# EAGLE design hapcan-dali (EAGLE 7.5.0)
PRODUCT_COMPANY: skagmo.com, 2015; PRODUCT_TITLE: HAPCAN compatible DALI gateway, rev. A
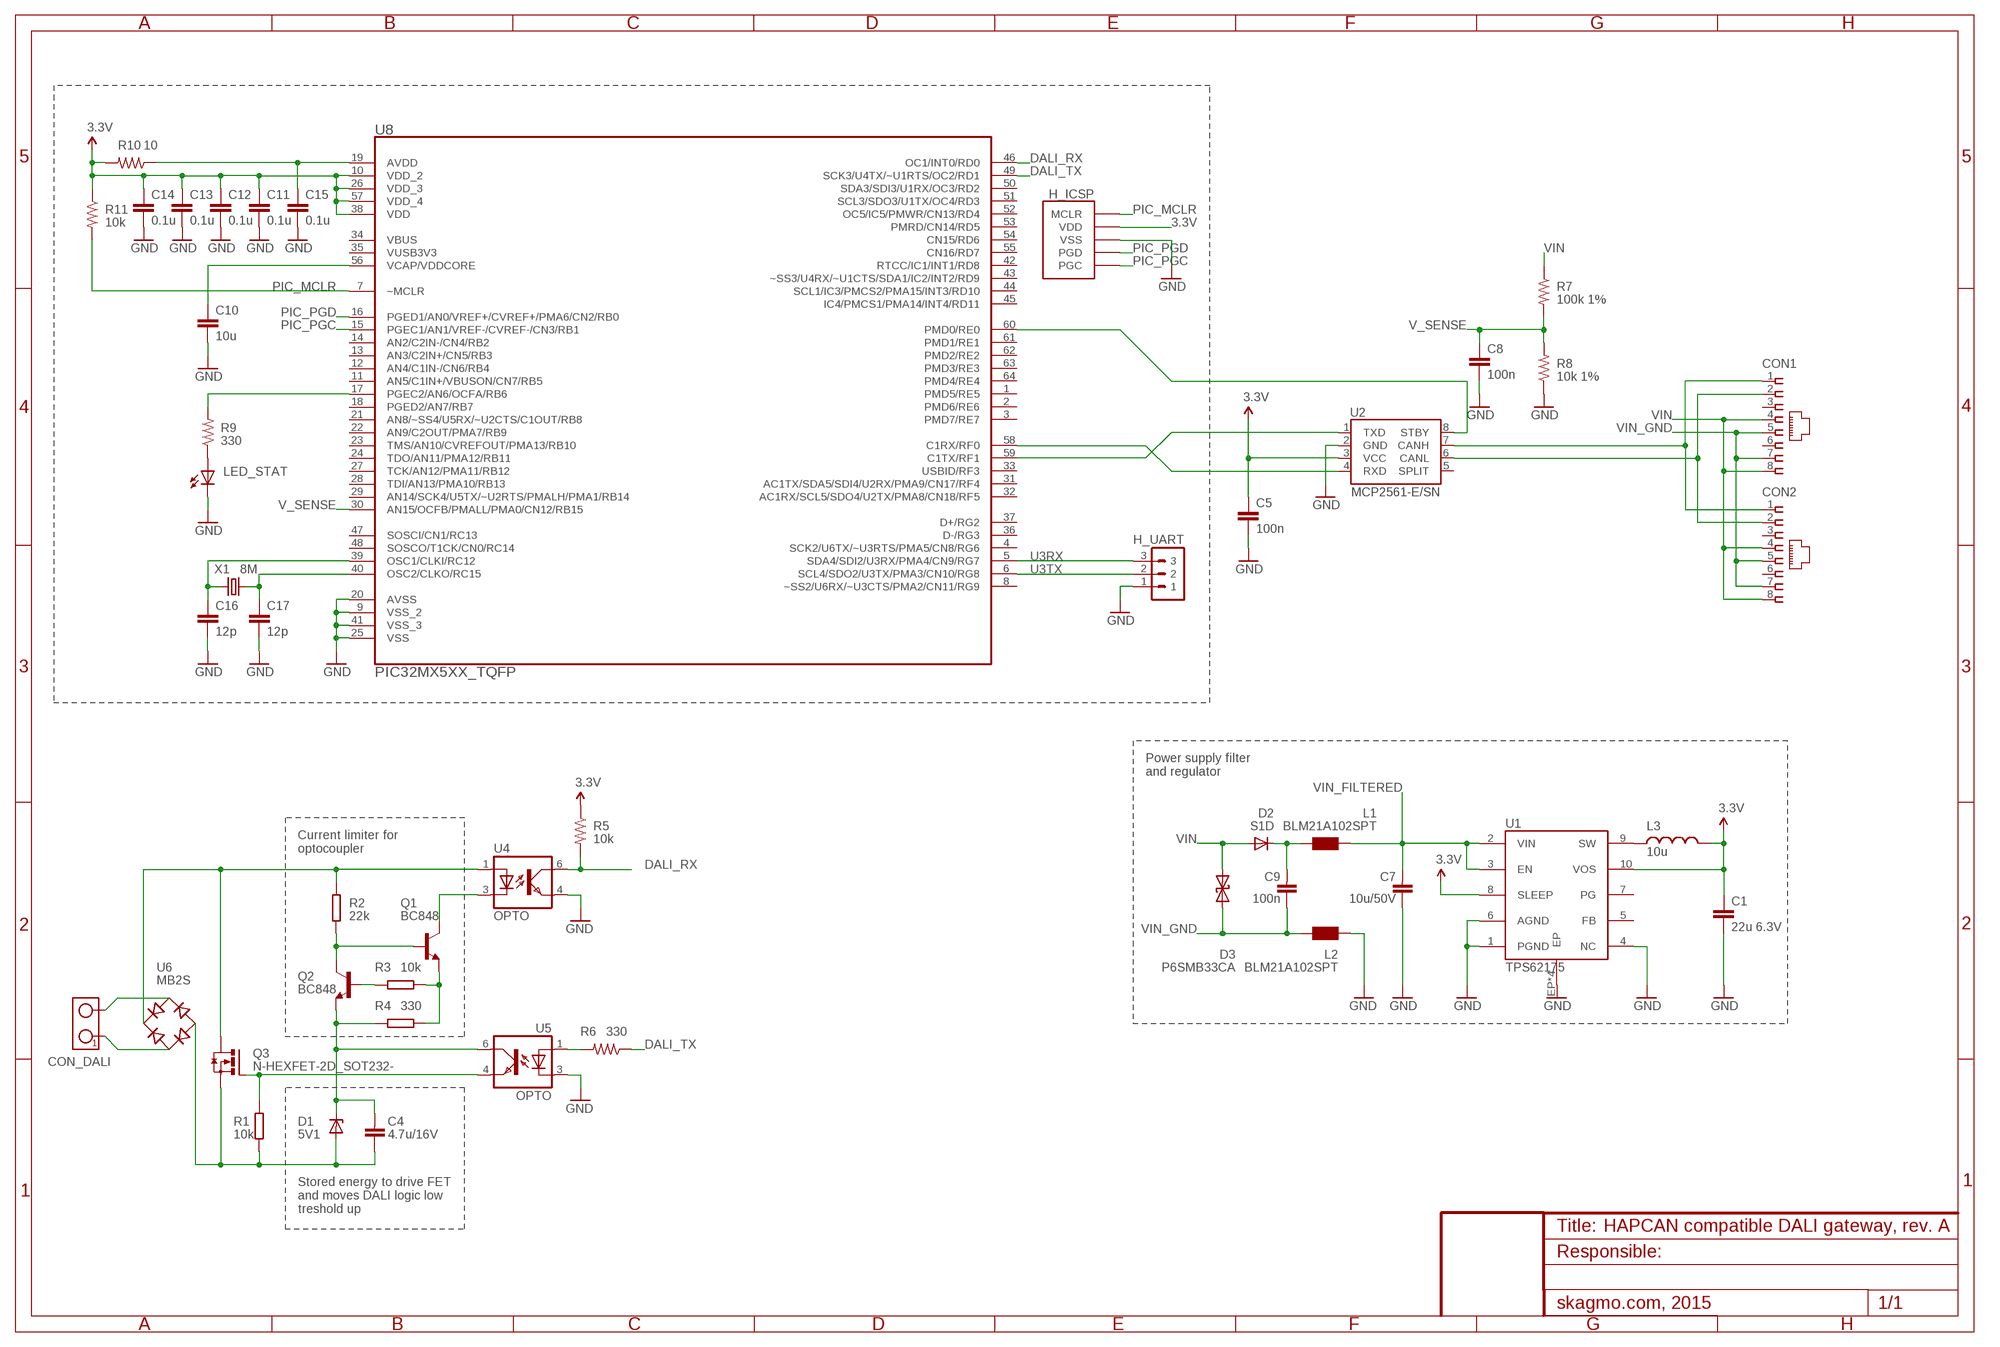
[diagram p0: schematic, sheet 1]

## Parts
C1  22u 6.3V  CAP0805  [0805]
C4  4.7u/16V  CAPACITOR0805  [0805]
C5  100n  CAP0603  [0603]
C7  10u/50V  CAPACITOR1210  [1210]
C8  100n  CAP0603  [0603]
C9  100n  CAPACITOR0805  [0805]
C10  10u  CAP0805  [0805]
C11  0.1u  CAP0603  [0603]
C12  0.1u  CAP0603  [0603]
C13  0.1u  CAP0603  [0603]
C14  0.1u  CAP0603  [0603]
C15  0.1u  CAP0603  [0603]
C16  12p  CAP0603  [0603]
C17  12p  CAP0603  [0603]
CON1  RJ45-SOCKET  [RJ45-PCB-SOCKET]
CON2  RJ45-SOCKET  [RJ45-PCB-SOCKET]
CON_DALI  TERMINAL-2  TERMINAL-2-5X10,5MM  [ARK2-5X10,5MM]
D1  5V1  ZENER-DIODESOT23  [SOT23]
D2  S1D  DIODE_DO-214  [DO-214]
D3  P6SMB33CA  DIODE_TRANSIL2  [DO-214_TRANSIL2]
H_ICSP  H1X5_ICSP  [H1X5_2MM]
H_UART  H1X3_XH  [CON_B3B-XH-A]
L1  BLM21A102SPT  CHOKE0805  [0805]
L2  BLM21A102SPT  CHOKE0805  [0805]
L3  10u  INDUCTOR_SRN3015  [IND-SRN3015]
LED_STAT  LEDCHIPLED_0805  [CHIPLED_0805]
Q1  BC848  [SOT23]
Q2  BC848  [SOT23]
Q3  N-HEXFET-2D_SOT232-  [SOT223]
R1  10k  RESISTOR0805  [0805]
R2  22k  RESISTOR0805  [0805]
R3  10k  RESISTOR0805  [0805]
R4  330  RESISTOR0805  [0805]
R5  10k  RESISTOR0603  [0603]
R6  330  RESISTOR0603  [0603]
R7  100k 1%  RESISTOR0603  [0603]
R8  10k 1%  RESISTOR0603  [0603]
R9  330  RESISTOR0603  [0603]
R10  10  RESISTOR0603  [0603]
R11  10k  RESISTOR0603  [0603]
U1  TPS62175  [WSON-10]
U2  MCP2561-E/SN  [SO-08]
U4  OPTO  [TLP185]
U5  OPTO  [TLP185]
U6  MB2S  [SOIC-4]
U8  PIC32MX5XX_TQFP  [TQFP64]
X1  8M  CRYSTAL_TXC-7A  [TXC-7A]

## Nets
3.3V: C1.1 C5.1 C11.1 C12.1 C13.1 C14.1 H_ICSP.2(VDD) L3.P$2 R5.1 R10.2 R11.1 U1.8(SLEEP) U1.10(VOS) U2.3(VCC) U8.10(VDD_2) U8.26(VDD_3) U8.38(VDD) U8.57(VDD_4)
CAN_N: CON1.2 CON2.2 U2.6(CANL)
CAN_P: CON1.1 CON2.1 U2.7(CANH)
DALI_RX: R5.2 U4.6(COL) U8.46(OC1/INT0/RD0)
DALI_TX: R6.1 U8.49(SCK3/U4TX/~U1RTS/OC2/RD1)
GND: C1.2 C5.2 C7.2 C8.2 C10.2 C11.2 C12.2 C13.2 C14.2 C15.2 C16.2 C17.2 H_ICSP.3(VSS) H_UART.1 L2.1 LED_STAT.C R8.1 U1.1(PGND) U1.4(NC) U1.6(AGND) U1.EP U1.V1(EP) U1.V2(EP) U1.V3(EP) U2.2(GND) U4.4(EMIT) U5.3(C) U8.9(VSS_2) U8.20(AVSS) U8.25(VSS) U8.41(VSS_3)
N$1: Q1.2(E) R3.1 R4.2
N$2: R9.2 U8.17(PGEC2/AN6/OCFA/RB6)
N$4: Q2.1(B) R3.2
N$5: C9.1 D2.C L1.2
N$6: Q1.1(B) Q2.3(C) R2.1
N$7: C4.2 D1.1(A) Q3.3(S) R1.1 U6.-
N$8: U2.8(STBY) U8.60(PMD0/RE0)
N$10: L3.P$1 U1.9(SW)
N$11: Q1.3(C) U4.3(C)
N$12: LED_STAT.A R9.1
N$13: C10.1 U8.56(VCAP/VDDCORE)
N$18: C16.1 U8.39(OSC1/CLKI/RC12) X1.1
N$19: CON_DALI.1 U6.~1(AC1)
N$20: CON_DALI.2 U6.~2(AC2)
N$23: Q3.1(G) R1.2 U5.4(EMIT)
N$24: Q3.2(D) Q3.4(D) R2.2 U4.1(A) U6.+
N$25: C17.1 U8.40(OSC2/CLKO/RC15) X1.2
N$28: C4.1 D1.3(C) Q2.2(E) R4.1 U5.6(COL)
N$30: R6.2 U5.1(A)
N$136: C15.1 R10.1 U8.19(AVDD)
N$15270: U2.1(TXD) U8.59(C1TX/RF1)
N$15271: U2.4(RXD) U8.58(C1RX/RF0)
PIC_MCLR: H_ICSP.1(MCLR) R11.2 U8.7(~MCLR)
PIC_PGC: H_ICSP.5(PGC) U8.15(PGEC1/AN1/VREF-/CVREF-/CN3/RB1)
PIC_PGD: H_ICSP.4(PGD) U8.16(PGED1/AN0/VREF+/CVREF+/PMA6/CN2/RB0)
U3RX: H_UART.3 U8.5(SDA4/SDI2/U3RX/PMA4/CN9/RG7)
U3TX: H_UART.2 U8.6(SCL4/SDO2/U3TX/PMA3/CN10/RG8)
V_SENSE: C8.1 R7.2 R8.2 U8.30(AN15/OCFB/PMALL/PMA0/CN12/RB15)
VIN: CON1.4 CON1.8 CON2.4 CON2.8 D2.A D3.C R7.1
VIN_FILTERED: C7.1 L1.1 U1.2(VIN) U1.3(EN)
VIN_GND: C9.2 CON1.5 CON1.7 CON2.5 CON2.7 D3.A L2.2
Unconnected: CON1.3 CON1.6 CON2.3 CON2.6 U1.5(FB) U1.7(PG) U2.5(SPLIT) U8.1(PMD5/RE5) U8.2(PMD6/RE6) U8.3(PMD7/RE7) U8.4(SCK2/U6TX/~U3RTS/PMA5/CN8/RG6) U8.8(~SS2/U6RX/~U3CTS/PMA2/CN11/RG9) U8.11(AN5/C1IN+/VBUSON/CN7/RB5) U8.12(AN4/C1IN-/CN6/RB4) U8.13(AN3/C2IN+/CN5/RB3) U8.14(AN2/C2IN-/CN4/RB2) U8.18(PGED2/AN7/RB7) U8.21(AN8/~SS4/U5RX/~U2CTS/C1OUT/RB8) U8.22(AN9/C2OUT/PMA7/RB9) U8.23(TMS/AN10/CVREFOUT/PMA13/RB10) U8.24(TDO/AN11/PMA12/RB11) U8.27(TCK/AN12/PMA11/RB12) U8.28(TDI/AN13/PMA10/RB13) U8.29(AN14/SCK4/U5TX/~U2RTS/PMALH/PMA1/RB14) U8.31(AC1TX/SDA5/SDI4/U2RX/PMA9/CN17/RF4) U8.32(AC1RX/SCL5/SDO4/U2TX/PMA8/CN18/RF5) U8.33(USBID/RF3) U8.34(VBUS) U8.36(D-/RG3) U8.37(D+/RG2) U8.42(RTCC/IC1/INT1/RD8) U8.43(~SS3/U4RX/~U1CTS/SDA1/IC2/INT2/RD9) U8.44(SCL1/IC3/PMCS2/PMA15/INT3/RD10) U8.45(IC4/PMCS1/PMA14/INT4/RD11) U8.47(SOSCI/CN1/RC13) U8.48(SOSCO/T1CK/CN0/RC14) U8.50(SDA3/SDI3/U1RX/OC3/RD2) U8.51(SCL3/SDO3/U1TX/OC4/RD3) U8.52(OC5/IC5/PMWR/CN13/RD4) U8.53(PMRD/CN14/RD5) U8.54(CN15/RD6) U8.55(CN16/RD7) U8.61(PMD1/RE1) U8.62(PMD2/RE2) U8.63(PMD3/RE3) U8.64(PMD4/RE4)

## Notes on the sheet
- Power supply filter
  and regulator
- Current limiter for
  optocoupler
- Stored energy to drive FET
  and moves DALI logic low 
  treshold up

## Power pins joined to a net without a drawn wire
VUSB3V3: U8.35(VUSB3V3)

## Library data of the parts
C1 C5 C8 C11-C15 = 01-eos-components:CAP: Capacitor Standard 0603 ceramic capacitor, and 0.1" leaded capacitor.
C4 C7 C9 = HAPCAN_devices - UNIV3:CAPACITOR: HAPCAN Capacitor
C10 C16 C17 = 01-eos-components:CAP: Capacitor Standard 0603 ceramic capacitor, and 0.1" leaded capacitor.; PARTNO: *
CON1 CON2 = HAPCAN_devices - UNIV3:RJ45-SOCKET: HAPCAN RJ45 socket
CON_DALI = HAPCAN_devices - UNIV3:TERMINAL-2: HAPCAN Terminal Block - 2 way
D1 = diode:ZENER-DIODE: Z-Diode
D2 = HAPCAN_devices - UNIV3:DIODE: HAPCAN Rectifier Diode
D3 = HAPCAN_devices - UNIV3-eagle5:DIODE_TRANSIL2: HAPCAN Bidirectional transil diode
H_ICSP = 01-eos-components:H1X5_ICSP; PARTNO: *
H_UART = 01-eos-components:H1X3: Header 3 Standard 3-pin 0.1" header. Use with straight break away headers (SKU : PRT-00116), right angle break away headers (PRT-00553), swiss pins (PRT-00743), machine pins (PRT-00117), and female headers (PRT-00115). Molex polarized connector foot print use with SKU : PRT-08232 with associated crimp pins and housings.
L1 L2 = HAPCAN_devices - UNIV3:CHOKE: Choke
L3 = 01-eos-components:INDUCTOR: Inductors Basic Inductor/Choke - 0603 and 1206. Footprints are not proven and vary greatly between part numbers.
LED_STAT = led:LED: LED OSRAM: - CHIPLED LG R971, LG N971, LY N971, LG Q971, LY Q971, LO R971, LY R971 LH N974, LH R974 LS Q976, LO Q976, LY Q976 LO Q996 - Hyper CHIPLED LW Q18S LB Q993, LB Q99A, LB R99A - SideLED LS A670, LO A670, LY A670, LG A670, LP A670 LB A673, LV A673, LT A673, LW A673 LH A674 LY A675 LS A676, LA A676, LO A676, LY A676, LW A676 LS A679, LY A679, LG A679 - Hyper Micro SIDELED® LS Y876, LA Y876, LO Y876, LY Y876 LT Y87S - SmartLED LW L88C, LW L88S LB L89C, LB L89S, LG L890 LS L89K, LO L89K, LY L89K LS L896, LA L896, LO L896, LY L896 - TOPLED LS T670, LO T670, LY T670, LG T670, LP T670 LSG T670, LSP T670, LSY T670, LOP T670, LYG T670 LG T671, LOG T671, LSG T671 LB T673, LV T673, LT T673, LW T673 LH T674 LS T676, LA T676, LO T676, LY T676, LB T676, LH T676, LSB T676, LW T676 LB T67C, LV T67C, LT T67C, LS T67K, LO T67K, LY T67K, LW E67C LS E67B, LA E67B, LO E67B, LY E67B, LB E67C, LV E67C, LT E67C LW T67C LS T679, LY T679, LG T679 LS T770, LO T770, LY T770, LG T770, LP T770 LB T773, LV T773, LT T773, LW T773 LH T774 LS E675, LA E675, LY E675, LS T675 LS T776, LA T776, LO T776, LY T776, LB T776 LHGB T686 LT T68C, LB T68C - Hyper Mini TOPLED® LB M676 - Mini TOPLED Santana® LG M470 LS M47K, LO M47K, LY M47K Source: http://www.osram.convergy.de LUXEON: - LUMILED® LXK2-PW12-R00, LXK2-PW12-S00, LXK2-PW14-U00, LXK2-PW14-V00 LXK2-PM12-R00, LXK2-PM12-S00, LXK2-PM14-U00 LXK2-PE12-Q00, LXK2-PE12-R00, LXK2-PE12-S00, LXK2-PE14-T00, LXK2-PE14-U00 LXK2-PB12-K00, LXK2-PB12-L00, LXK2-PB12-M00, LXK2-PB14-N00, LXK2-PB14-P00, LXK2-PB14-Q00 LXK2-PR12-L00, LXK2-PR12-M00, LXK2-PR14-Q00, LXK2-PR14-R00 LXK2-PD12-Q00, LXK2-PD12-R00, LXK2-PD12-S00 LXK2-PH12-R00, LXK2-PH12-S00 LXK2-PL12-P00, LXK2-PL12-Q00, LXK2-PL12-R00 Source: www.luxeon.com KINGBRIGHT: KA-3528ASYC Source: www.kingbright.com; PARTNO: *
Q1 Q2 = transistor-neu-to92:BC848: NPN TRANSISTOR
Q3 = transistor-power:N-HEXFET-2D_?-*: HEXFET® Power MOSFET 2 Drain connects http://www.irf.com/product-info/datasheets/data/irll014n.pdf
R1-R4 = HAPCAN_devices - UNIV3:RESISTOR: HAPCAN Resistor
R5-R8 = 01-eos-components:RESISTOR: Resistor Basic schematic elements and footprints for 0603, 1206, and PTH 1/10th watt (small) resistors.
R9-R11 = 01-eos-components:RESISTOR: Resistor Basic schematic elements and footprints for 0603, 1206, and PTH 1/10th watt (small) resistors.; PARTNO: *
U1 = 03-vhf_sdr:TPS62175
U2 = HAPCAN_devices - UNIV3:MCP2561: HAPCAN CAN Tranceiver
U4 U5 = 01-eos-components:OPTO
U6 = rectifier:MB*S: Bridge Rectifier Source: http://www.fairchildsemi.com/ds/MB/MB6S.pdf
U8 = 01-eos-components:PIC32MX5XX: IC, 32BIT MCU
X1 = 00-mr-library:CRYSTAL; PARTNO: *

## Board
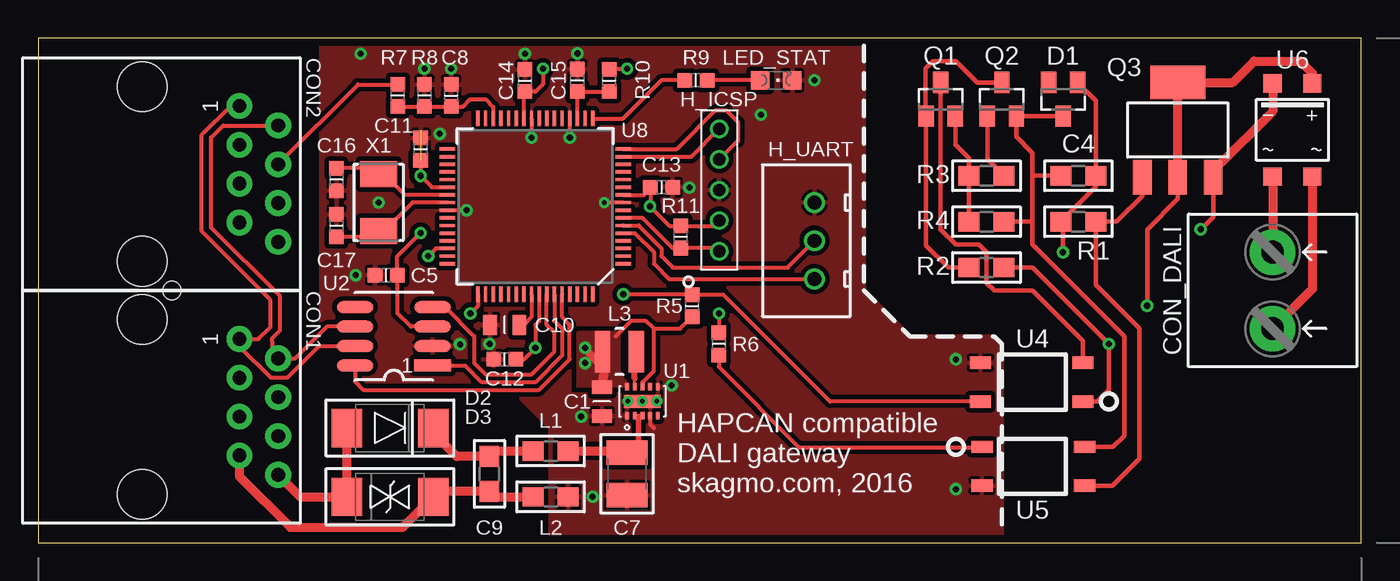
[diagram p1: board, top side]
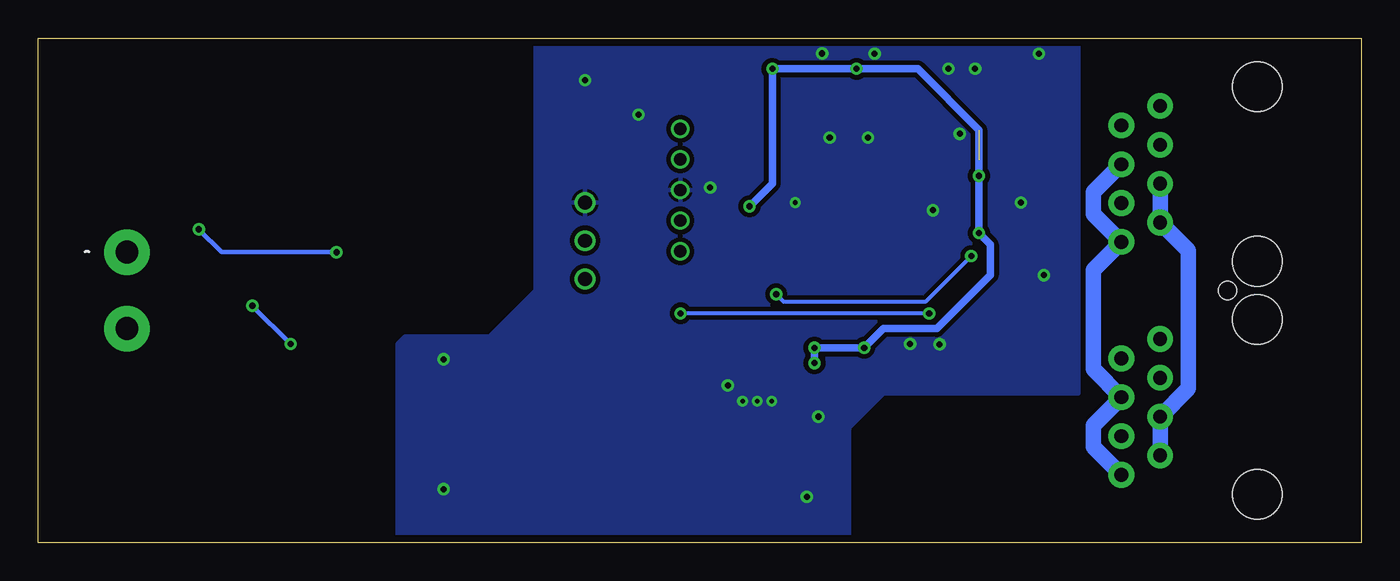
[diagram p2: board, bottom side, seen from below]

Size 86.5 x 33 mm. Coordinates in mm from the lower left corner, seen from the top.
Outline: 0,33 0,0 86.5,0 86.5,33 0,33
Copper layers (1+2*15+16): Top 0.035mm / dielectric 0.2mm / Route2 0.035mm / dielectric 1mm / Route15 0.035mm / dielectric 0.2mm / Bottom 0.035mm
Design rules "mr_drc *": minimum track width 0.15mm, minimum drill 0.3mm, track to track 0.15mm, track to pad 0.15mm, pad to pad 0.15mm, via to via 0.15mm, smd to smd 0.05mm, copper to edge 0.5mm, drill to drill 0.5mm, minimum pad ring 0.2mm, minimum via ring 0.2mm, stop-mask expansion 0.05mm, vias tented up to drill 0.8mm, thermal gap 0.2mm
Holes 1.2 mm at 8.74,16.5
tKeepout: 4 lines

### Footprints (pad centres in the part's own frame; a part is rotated, then mirrored left to right if it is on the bottom)
0805 = smd 0.9 x 1.3: 1 -0.95,0; 2 0.95,0
0805' = smd 1.372 x 1.27: 1 -1.143,0; 2 1.143,0
0603 = smd 0.95 x 0.95: 1 -0.725,0; 2 0.725,0
1210 = smd 1.6 x 2.7: 1 -1.4,0; 2 1.4,0
RJ45-PCB-SOCKET = drill 0.9 pad 1.676: 1 -4.445,6.35; 2 -3.175,8.89; 3 -1.905,6.35; 4 -0.635,8.89; 5 0.635,6.35; 6 1.905,8.89; 7 3.175,6.35; 8 4.445,8.89 | hole 3.251: -5.715,0; 5.715,0
ARK2-5X10,5MM = drill 1.5 pad 3: 1 -2.5,0; 2 2.5,0
SOT23 = smd 1 x 1.4: 1 -0.95,-1.1; 2 0.95,-1.1; 3 0,1.1
DO-214 = smd 2 x 2.5: A 2.82,0; C -2.82,0
DO-214_TRANSIL2 = smd 2 x 2.5: A 2.82,0; C -2.82,0
H1X5_2MM = drill 0.8: 1 -4,0; 2 -2,0; 3 0,0; 4 2,0; 5 4,0
CON_B3B-XH-A = drill 0.9: 1 -2.5,0; 2 0,0; 3 2.5,0
IND-SRN3015 = smd 2.7 x 1: P$1 0,1.1; P$2 0,-1.1
CHIPLED_0805 = smd 1.2 x 1.2: A 0,-1.05; C 0,1.05
SOT223 = smd 1.219 x 2.235: 1 -2.311,-3.099; 2 0,-3.099; 3 2.311,-3.099 | smd 3.6 x 2.2: 4 0,3.099
WSON-10 = smd 0.5 x 0.25: 1 -0.95,1; 2 -0.95,0.5; 3 -0.95,0; 4 -0.95,-0.5; 5 -0.95,-1; 6 0.95,-1; 7 0.95,-0.5; 8 0.95,0; 9 0.95,0.5; 10 0.95,1 | smd 0.84 x 2.4: EP 0,0 | drill 0.3 pad 0.406: V1 0,0.95; V2 0,0; V3 0,-0.95
SO-08 = smd 2.4 x 0.8: 1 -2.54,1.905; 2 -2.54,0.635; 3 -2.54,-0.635; 4 -2.54,-1.905; 5 2.54,-1.905; 6 2.54,-0.635; 7 2.54,0.635; 8 2.54,1.905
TLP185 = smd 0.8 x 1.4: 1 -1.27,-3.3; 3 1.27,-3.3; 4 1.27,3.4; 6 -1.27,3.4
SOIC-4 = smd 1.2 x 1.2: + 1.3,3.05; - -1.3,3.05; ~1 -1.3,-3.05; ~2 1.3,-3.05
TQFP64 = smd 0.22 x 1: 1 -3.75,-5.75; 2 -3.25,-5.75; 3 -2.75,-5.75; 4 -2.25,-5.75; 5 -1.75,-5.75; 6 -1.25,-5.75; 7 -0.75,-5.75; 8 -0.25,-5.75; 9 0.25,-5.75; 10 0.75,-5.75; 11 1.25,-5.75; 12 1.75,-5.75; 13 2.25,-5.75; 14 2.75,-5.75; 15 3.25,-5.75; 16 3.75,-5.75; 33 3.75,5.75; 34 3.25,5.75; 35 2.75,5.75; 36 2.25,5.75; 37 1.75,5.75; 38 1.25,5.75; 39 0.75,5.75; 40 0.25,5.75; 41 -0.25,5.75; 42 -0.75,5.75; 43 -1.25,5.75; 44 -1.75,5.75; 45 -2.25,5.75; 46 -2.75,5.75; 47 -3.25,5.75; 48 -3.75,5.75 | smd 1 x 0.22: 17 5.75,-3.75; 18 5.75,-3.25; 19 5.75,-2.75; 20 5.75,-2.25; 21 5.75,-1.75; 22 5.75,-1.25; 23 5.75,-0.75; 24 5.75,-0.25; 25 5.75,0.25; 26 5.75,0.75; 27 5.75,1.25; 28 5.75,1.75; 29 5.75,2.25; 30 5.75,2.75; 31 5.75,3.25; 32 5.75,3.75; 49 -5.75,3.75; 50 -5.75,3.25; 51 -5.75,2.75; 52 -5.75,2.25; 53 -5.75,1.75; 54 -5.75,1.25; 55 -5.75,0.75; 56 -5.75,0.25; 57 -5.75,-0.25; 58 -5.75,-0.75; 59 -5.75,-1.25; 60 -5.75,-1.75; 61 -5.75,-2.25; 62 -5.75,-2.75; 63 -5.75,-3.25; 64 -5.75,-3.75
TXC-7A = smd 1.7 x 2.4: 1 -1.85,0; 2 1.85,0

### Placement (x,y rotation side)
C1  36.85,9.23 270 top
C4  4.7u/16V  [0805']  68,24 0 top
C5  22.75,17.5 180 top
C7  38.5,4.5 270 top
C8  27,29.25 90 top
C9  100n  [0805']  29.5,4.5 270 top
C10  30.5,14.25 180 top
C11  25,25.75 90 top
C12  30.5,12 180 top
C13  40.75,23.25 0 top
C14  31.82,30.23 90 top
C15  35.25,30.25 90 top
C16  19.5,23.75 270 top
C17  19.5,20.75 90 top
CON1  6.8,8.88 270 top
CON2  6.8,24.12 270 top
CON_DALI  80.7,16.5 270 top
D1  67,29 180 top
D2  23,7.5 180 top
D3  23,3 0 top
H_ICSP  44.52,23.07 90 top
H_UART  50.75,19.75 270 top
L1  BLM21A102SPT  [0805']  33.5,6 180 top
L2  BLM21A102SPT  [0805']  33.5,3 180 top
L3  38,12.5 270 top
LED_STAT  48.25,30.25 270 top
Q1  59,29 0 top
Q2  63,29 0 top
Q3  74.5,27 0 top
R1  10k  [0805']  68,21 0 top
R2  22k  [0805']  62,18 0 top
R3  10k  [0805']  62,24 0 top
R4  330  [0805']  62,21 180 top
R5  42.75,15.5 90 top
R6  44.5,13 270 top
R7  23.5,29.25 270 top
R8  25.25,29.25 270 top
R9  43,30.25 180 top
R10  37.32,30.23 90 top
R11  42,20 270 top
U1  39.5,9.25 90 top
U2  23.25,13.5 180 top
U4  65,10.5 90 top
U5  65,5 270 top
U6  82,27 0 top
U8  32.5,22 90 top
X1  22.25,22.25 270 top

### Tracks (layer width: path | path; a pad name or v marks a point on that pad's centre or on a via)
3.3V  (via drill 0.4)  (1 unrouted)
  Top 0.25: C11.1 v25,24 25.75,23.25 U8.38 | C13.1 arc90 40.07,23.2 40.09,23.18 | R10.2 37.5,31 v38.5,31 | v33,31 33,30 32.5,29.5 32,29.5 C14.1 31.75,29.43 U8.26 | 40,23.25 C13.1 | U8.57 32.75,14.5 32.5,14.25 v32.5,12.75 31.75,12 C12.1 | U8.10 39.59,22.75 40.07,23.23 C13.1 | H_ICSP.2 44.17,20.73 R11.1 41.27,20.73 v40,22 40.02,22.02 C13.1 | U2.3 24.36,14.13 23.48,15.03 C5.1 23.48,18.73 v25,20.25 | U1.8 39.5,10.5 40.25,11.25 40.25,14 | 40.25,14 39.75,14.5 38.75,14.5 37.75,13.5 | 40.25,14 41.98,14 R5.1
  Top 0.5: 37.03,11.25 v35.75,12.75
  Top 0.6: C1.1 37.03,11.25
  Bottom 0.5: v40,22 38.5,23.5 v38.5,31 v33,31 29,31 25,27 v25,20.25 24.25,19.5 24.25,17.5 27.75,14 31.25,14 v32.5,12.75 v35.75,12.75 v35.75,11.75
  pour Top (no thermals): 38,13.75 35.25,13.75 35.25,10.25 38.5,10.25 38.5,10.48 38,11
CAN_N
  Top 0.25: CON2.2 12.1,27.3 11.3,26.5 11.3,20.63 15.8,16.13 15.8,13.87 15.3,13.37 15.3,13.13 15.3,12.44 CON1.2 16.8,12.05 18.89,14.13 U2.6
CAN_P
  Top 0.25: CON2.1 12.56,28.57 10.7,26.7 10.7,20.37 15.2,15.87 15.2,14.13 14.39,13.32 CON1.1 13.15,12.85 15.2,10.8 16.23,10.8 16.3,10.8 18.36,12.87 U2.7
DALI_RX  (via drill 0.4)
  Top 0.25: U4.6 51.77,9.23 44.77,16.23 R5.2 42.77,16.23 42.25,16.25 v38.25,16.25 | U8.46 26,19.25 v25.5,18.75
  Bottom 0.25: v25.5,18.75 28.5,15.75 37.75,15.75 v38.25,16.25
DALI_TX  (via drill 0.4)
  Top 0.25: U8.49 28.75,15.5 v28.25,15 | v44.5,15 R6.1
  Bottom 0.25: v28.25,15 v44.5,15
GND  (via drill 0.3, 0.4)
  Top 0.25: U8.9 v37,22.25 | U8.20 v34.75,26.5 | U8.25 v32.25,26.5 | U8.41 v28,21.75 | U1.4 40,7.75 40.25,7.5
  other vias: 26.25,26.75 47.25,28 20.75,17.5 50.75,30.25 36.25,3 35.25,32 60,3.5 60,12 21.07,31.98 27,31 42.57,23.23 31.82,31.98 22.25,22.25 27.57,12.98 25.25,31 41.41,10.29 29.5,13 35.5,8.25
  pour Top (isolate 0.305, rank 2): 63,-0.5 33.5,-0.5 33.5,7.5 31.25,9.75 18.5,9.75 18.5,33.5 54,33.5 54,16.5 57,13.5 62.5,13.5 63,13
  pour Bottom (isolate 0.305): 63,-0.5 33.5,-0.5 33.5,7.5 31.25,9.75 18.5,9.75 18.5,33.5 54,33.5 54,16.5 57,13.5 62.5,13.5 63,13
N$1
  Top 0.305: R4.2 R3.1 60.86,25.14 59.95,26.05 Q1.2
N$2
  Top 0.25: R9.2 40.75,30.25 38.25,27.75 U8.17
N$4
  Top 0.305: Q2.1 62.05,25.09 R3.2
N$5
  Top 0.6: L1.2 29.86,6 C9.1 27.36,5.64 26.5,6.5 D2.C
N$6
  Top 0.305: R2.1 59.5,18 58.05,19.45 Q1.1 58,28.45 58,31 58.5,31.5 60,31.5 61.4,30.1 Q2.3
N$7  (via drill 0.4)
  Top 0.3: D1.1 69.14,28.91 C4.2 69.14,23.29 R1.1 67,20.86 v67,19 | v76,20.5 76.81,21.31 Q3.3
  Top 0.6: Q3.3 77,24.5 80.7,28.2 U6.-
  Bottom 0.3: v67,19 74.5,19 v76,20.5
N$8
  Top 0.25: U2.8 20.71,10.54 21.25,10 32.75,10 34.75,12 34.75,14.25 34.25,14.75 U8.60
N$10
  Top 0.2: U1.9 39,10.75
  Top 0.4: 39,10.75 39,12.25 38.85,12.33 L3.P$1
N$11
  Top 0.305: Q1.3 59,20.5 60,19.5 61.5,19.5 62,19 62,17 62.5,16.5 65,16.5 68.3,13.2 U4.3
N$12
  Top 0.25: LED_STAT.A R9.1
N$13
  Top 0.25: U8.56 32.25,14.75 31.75,14.25 C10.1
N$18
  Top 0.25: C16.1 19.52,24.5 21.5,24.5 22.27,24.02 X1.1 22.75,24.25 23.25,23.75 23.25,23.5 24,22.75 U8.39
N$19
  Top 0.6: U6.~1 CON_DALI.1
N$20
  Top 0.6: U6.~2 83.3,16.6 CON_DALI.2
N$23
  Top 0.3: U5.4 70.23,3.73 72,5.5 72,14 69.14,16.86 R1.2 70.5,21 72.19,22.69 Q3.1
N$24  (via drill 0.4)
  Top 0.3: U4.1 69.23,9.23 70,10 v70,13 65,18 R2.2 | v72.5,15.5 72.5,20.5 74.5,22.5 Q3.2
  Top 0.6: U6.+ 83.3,30.7 82.5,31.5 79.5,31.5 78.1,30.1 Q3.4 Q3.2
  Bottom 0.3: v70,13 v72.5,15.5
N$25
  Top 0.25: 22.8,20.59 X1.2 22.23,20.48 21.5,20 19.52,20 C17.1 | 22.8,20.59 23.25,20.75 | U8.40 24.46,22.25 22.8,20.59
N$28
  Top 0.3: 63.45,21.31 R4.1 65,21 65,19.5 71,13.5 71,7 70.27,6.27 U5.6 | C4.1 65,24
  Top 0.305: 65,21 65,24 65,25.5 63.95,26.55 Q2.2 D1.3
N$30
  Top 0.25: R6.2 44.5,11.5 49.75,6.25 61.68,6.25 U5.1
N$136
  Top 0.25: 35.32,29.48 35.34,29.5 | 35.34,29.5 C15.1 U8.19 | 35.34,29.5 R10.1
N$15270
  Top 0.25: U8.59 33.75,14.5 34.25,14 34.25,12.25 32.5,10.5 29,10.5 27.91,11.6 U2.1
N$15271
  Top 0.25: U2.4 26.59,15.4 28.5,13.5 28.5,11.75 29.25,11 32.25,11 33.75,12.5 33.75,13.75 33.25,14.25 U8.58
PIC_MCLR
  Top 0.25: H_ICSP.1 44.31,19.27 R11.2 41.48,19.27 39.5,21.25 U8.7
PIC_PGC
  Top 0.25: U8.15 42.7,25.25 H_ICSP.5
PIC_PGD
  Top 0.25: U8.16 41.75,25.75 44.25,28.25 45,28.25 45.75,27.5 45.75,26.3 H_ICSP.4
U3RX
  Top 0.25: U8.5 39,20.25 40.25,19 40.25,18.25 41.25,17.25 H_UART.3
U3TX
  Top 0.25: U8.6 39.25,20.75 40.75,19.25 40.75,18.75 41.5,18 49,18 H_UART.2
V_SENSE
  Top 0.25: R7.2 R8.2 C8.1 27.77,28.52 28.25,29 29.25,29 29.75,28.5 U8.30
VIN
  Top 0.25: CON2.4 20.91,29.98 R7.1
  Top 0.6: CON1.8 17.12,3 D3.C D2.A
  Bottom 1: CON2.4 17.5,22.92 17.5,21.51 CON2.8 17.5,17.84 17.5,11.35 CON1.4 17.5,7.68 17.5,6.27 CON1.8
VIN_FILTERED
  Top 0.2: U1.2 39.25,8.25 U1.3
  Top 0.25: C7.1 39,6
  Top 0.3: 38.4,6 C7.1
  Top 0.35: 39,6 39.25,6.25 39.25,8.25
  Top 0.6: L1.1 38.4,6
VIN_GND
  Top 0.6: CON1.7 13.15,4.35 16.5,1 23.82,1 D3.A 26.46,3.36 C9.2 29.86,3 L2.2
  Bottom 1: CON2.5 CON2.7 11.3,19.1 11.3,10.09 CON1.5 CON1.7

### Text on the board
_tsilk: HAPCAN compatible / DALI gateway / skagmo.com, 2016